# EAGLE schematic 3wire-1602-panel (EAGLE 5.07)
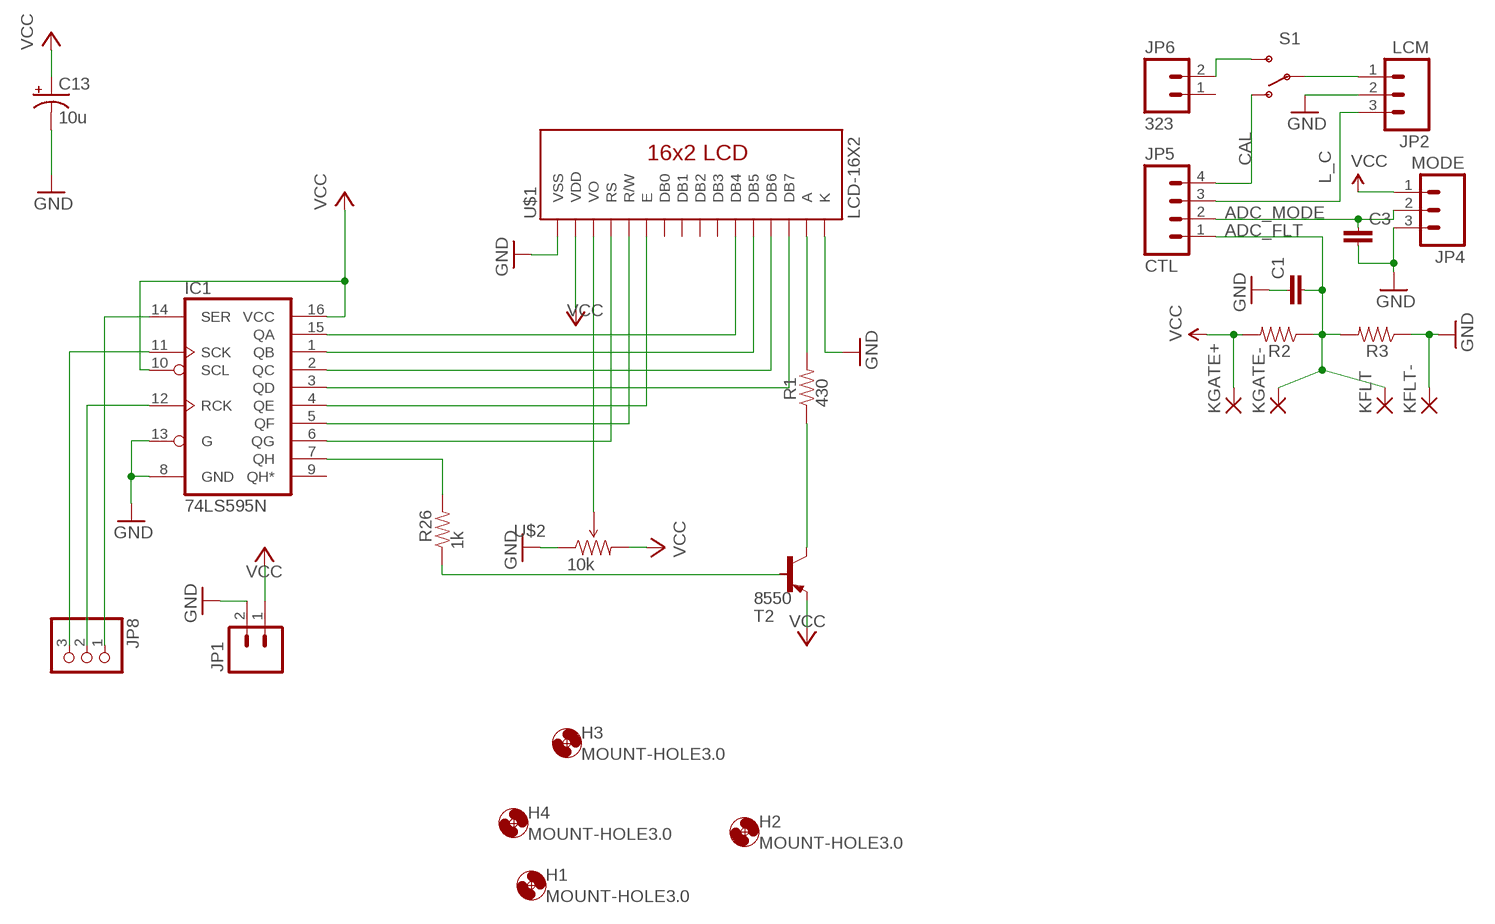
[diagram p0: schematic, sheet 1]

## Parts
C1  CAPPTH1  [CAP-PTH-5MM]
C3  CAPPTH1  [CAP-PTH-5MM]
C13  10u  CAP_POL1206  [EIA3216]
H1  MOUNT-HOLE3.0  [3,0]
H2  MOUNT-HOLE3.0  [3,0]
H3  MOUNT-HOLE3.0  [3,0]
H4  MOUNT-HOLE3.0  [3,0]
IC1  74LS595N  [DIL16]
JP1  CON-02-XH  [XH-1X2-LONG-LOCK]
JP2  LCM  M03LOCK_LONGPADS  [1X03_LOCK_LONGPADS]
JP4  MODE  M03LOCK_LONGPADS  [1X03_LOCK_LONGPADS]
JP5  CTL  M04LOCK_LONGPADS  [1X04_LOCK_LONGPADS]
JP6  323  CON-02LOCK_LONGPADS  [1X02_LOCK_LONGPADS]
JP8  PINHD-1X3/90-LOCK  [1X03/90_LOCK]
KFLT  3,81/1,4  [3,81/1,4]
KFLT-  3,81/1,4  [3,81/1,4]
KGATE+  3,81/1,4  [3,81/1,4]
KGATE-  3,81/1,4  [3,81/1,4]
R1  430  RESISTOR1/4W  [AXIAL-0.3]
R2  RESISTOR1/4W  [AXIAL-0.3]
R3  RESISTOR1/4W  [AXIAL-0.3]
R26  1k  RESISTOR1/4W  [AXIAL-0.3]
S1  SWITCH-SPST3AM6  [SWITCH-SPDT-AM#6]
T2  8550  -PNP-TO92-EBC  [TO92-EBC]
U$1  LCD-16X2  LCD-16X2-STD  [LCD-16X2]
U$2  10k  TRIMPOTPTH  [TRIM_POT_PTH]

## Nets
ADC_FLT: C1.2 JP5.1 KFLT.1(P) KGATE-.1(P) R2.P$1 R3.P$2
ADC_MODE: C3.1 JP4.2 JP5.2
CAL: JP5.4 S1.1(O)
GND: C1.1 C3.2 C13.C(-) IC1.8(GND) IC1.13(G) JP1.2 JP2.2 JP4.3 KFLT-.1(P) R3.P$1 U$1.1(VSS) U$1.16(K) U$2.1(CCW)
L_C: JP2.3 JP5.3
N$1: IC1.15(QA) U$1.11(DB4)
N$2: IC1.1(QB) U$1.12(DB5)
N$3: IC1.2(QC) U$1.13(DB6)
N$4: IC1.3(QD) U$1.14(DB7)
N$5: IC1.4(QE) U$1.6(E)
N$6: IC1.5(QF) U$1.5(R/W)
N$7: IC1.6(QG) U$1.4(RS)
N$8: IC1.7(QH) R26.P$2
N$10: IC1.14(SER) JP8.1
N$11: IC1.11(SCK) JP8.3
N$12: JP2.1 S1.2(P)
N$13: IC1.12(RCK) JP8.2
N$14: JP6.2 S1.3(S)
N$15: U$1.3(VO) U$2.2(WIPER)
N$16: R1.P$2 U$1.15(A)
N$19: R1.P$1 T2.C
N$55: R26.P$1 T2.B
VCC: C13.A(+) IC1.10(SCL) IC1.16(VCC) JP1.1 JP4.1 KGATE+.1(P) R2.P$2 T2.E U$1.2(VDD) U$2.3(CW)
Unconnected: IC1.9(QH*) JP6.1 U$1.7(DB0) U$1.8(DB1) U$1.9(DB2) U$1.10(DB3)

## Library data of the parts
C1 C3 = digital-toy:CAP: Capacitor Standard 0603 ceramic capacitor, and 0.1" leaded capacitor.
C13 = SparkFun:CAP_POL: Capacitor Polarized These are standard SMD and PTH capacitors. Normally 10uF, 47uF, and 100uF in electrolytic and tantalum varieties. Always verify the external diameter of the through hole cap, it varies with capacity, voltage, and manufacturer. The EIA devices should be standard.
H1-H4 = holes:MOUNT-HOLE: MOUNTING HOLE with drill center marker
IC1 = SparkFun:74*595: 8-bit SHIFT REGISTER, output latch
JP1 JP6 = digital-toy:CON-02: Header 2 Standard 2-pin 0.1" header. Use with straight break away headers (SKU : PRT-00116), right angle break away headers (PRT-00553), swiss pins (PRT-00743), machine pins (PRT-00117), and female headers (PRT-00115). Molex polarized connector foot print use with SKU : PRT-08233 with associated crimp pins and housings.
JP2 JP4 = digital-toy:M03: Header 3 Standard 3-pin 0.1" header. Use with straight break away headers (SKU : PRT-00116), right angle break away headers (PRT-00553), swiss pins (PRT-00743), machine pins (PRT-00117), and female headers (PRT-00115). Molex polarized connector foot print use with SKU : PRT-08232 with associated crimp pins and housings.
JP5 = SparkFun:M04: Header 4 Standard 4-pin 0.1" header. Use with straight break away headers (SKU : PRT-00116), right angle break away headers (PRT-00553), swiss pins (PRT-00743), machine pins (PRT-00117), and female headers (PRT-00115). Molex polarized connector foot print use with SKU : PRT-08231 with associated crimp pins and housings. 1MM SMD Version SKU: PRT-10208
JP8 = digital-toy:PINHD-1X3: PIN HEADER
KFLT KFLT- KGATE+ KGATE- = wirepad:3,81/1,4: THROUGH-HOLE PAD
R1-R3 R26 = digital-toy:RESISTOR: Resistor Basic schematic elements and footprints for 0603, 1206, and PTH 1/10th watt (small) resistors. digital-toy copy vertical mount of axial-0.3 from rcl.lbr : the 0207/xx 3W resistor: 0617/17, 0617/22, 0617V
S1 = digital-toy:SWITCH-SPST: SPST Switch Simple slide switch. Spark Fun Electronics SKU : COM-00102
T2 = digital-toy:*-PNP-: PNP Transistror
U$1 = digital-toy:LCD-16X2: LCD 1602 1602 STD standard lcd1602 1602 YHDS buy from taobao: DV162B4 S2FBLY-H-DS by hyl digital-toy
U$2 = SparkFun:TRIMPOT